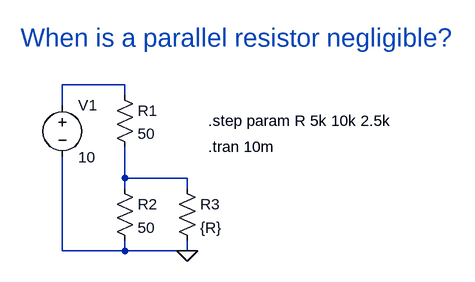
[diagram p0: schematic Parallel-resistor-when-negligible.asc]
Parallel-resistor-when-negligible.asc, the LTspice schematic file:
Version 4.1
SHEET 1 880 680
WIRE 80 288 80 304
WIRE 176 288 176 304
WIRE -16 160 -16 176
WIRE 80 304 176 304
WIRE 80 304 -16 304
WIRE -16 304 -16 176
FLAG 176 304 0
WIRE 80 64 80 48
WIRE -16 80 -16 64
WIRE 80 48 -16 48
WIRE -16 48 -16 64
WIRE 80 144 80 160
WIRE 80 208 80 192
WIRE 176 208 176 192
WIRE 80 160 80 192
WIRE 80 192 176 192
SYMBOL res 64 48 R0
SYMATTR InstName R1
SYMATTR Value 50
SYMBOL res 64 192 R0
SYMATTR InstName R2
SYMATTR Value 50
SYMBOL res 160 192 R0
SYMATTR InstName R3
SYMATTR Value {R}
SYMBOL voltage -16 64 R0
WINDOW 123 0 0 Left 2
WINDOW 39 0 0 Left 2
SYMATTR InstName V1
SYMATTR Value 10
TEXT 208 104 Left 2 !.step param R 5k 10k 2.5k
TEXT 208 144 Left 2 !.tran 10m
TEXT -80 -24 Left 4 ;When is a parallel resistor negligible?

The netlist it stands for:
* Parallel-resistor-when-negligible.asc
R1 N001 N002 50
R2 N002 0 50
R3 N002 0 {R}
V1 N001 0 10
.step param R 5k 10k 2.5k
.tran 10m
* When is a parallel resistor negligible?
.backanno
.end